# Altium schematic sheet Digital Circuitry.SchDoc
size A4; SheetNumber: 3; SheetTotal: 6
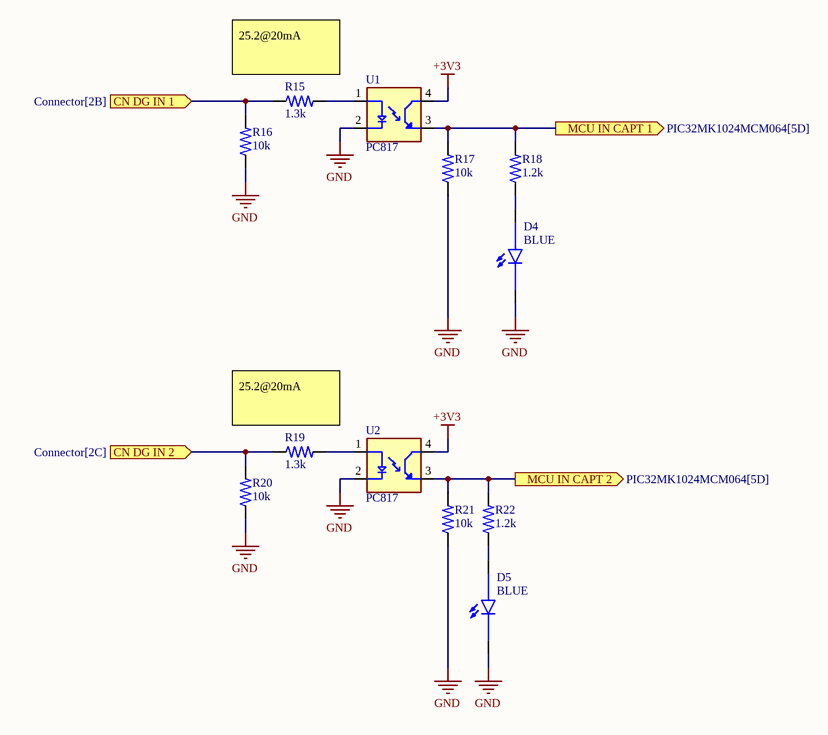
[diagram p0: Digital Circuitry.SchDoc]

## Parts
D4  BLUE  [LED 0805]
D5  BLUE  [LED 0805]
R15  1.3k  [0805]
R16  10k  [0805]
R17  10k  [0805]
R18  1.2k  [0805]
R19  1.3k  [0805]
R20  10k  [0805]
R21  10k  [0805]
R22  1.2k  [0805]
U1  PC817  [PC817]
U2  PC817  [PC817]

## Ports
CN DG IN 1 (in, see Connector[2B]), CN DG IN 2 (in, see Connector[2C]), MCU IN CAPT 1 (out, see PIC32MK1024MCM064[5D]), MCU IN CAPT 2 (out, see PIC32MK1024MCM064[5D])

## Nets
+3V3: U1.4(CT) U2.4(CT)
GND: D4.C D5.C R16.1 R17.1 R20.1 R21.1 U1.2(C) U2.2(C)
CN DG IN 1: R15.1 R16.2 ; port CN DG IN 1
CN DG IN 2: R19.1 R20.2 ; port CN DG IN 2
MCU IN CAPT 1: R17.2 R18.2 U1.3(ET) ; port MCU IN CAPT 1
MCU IN CAPT 2: R21.2 R22.2 U2.3(ET) ; port MCU IN CAPT 2
NetD4_A: D4.A R18.1
NetD5_A: D5.A R22.1
NetR15_2: R15.2 U1.1(A)
NetR19_2: R19.2 U2.1(A)

## Notes on the sheet
- 25.2@20mA

## Library data of the parts
D4 D5 = LED 0805: LED Uni-Color Green 4-Pin Chip 0805 T/R; MP: 597-3305-607F; Availability: Unavailable; Value: *; Price: None; Package: None
R15-R22 = 0805_Resistor: Power_Rating: .25 W; MP: 2-2176053-0; Tolerance: 1%; Resistance: .33; MF: TE Connectivity; Price: None; Availability: In Stock; EU_RoHS_Compliance: Compliant with Exemptions; Package: 0805; Value: *; SnapEDA_Link: https://www.snapeda.com/parts/2-2176053-0/TE+Connectivity/view-part/?ref=snap; Check_prices: https://www.snapeda.com/parts/2-2176053-0/TE+Connectivity/view-part/?ref=eda
U1 U2 = PC817: Optoisolator Transistor Output 5000Vrms 1 Channel 4-SMD; MP: PC817XI; MF: Sharp Microelectronics; Price: None; Availability: In Stock; Package: SMD-4 Sharp Microelectronics; Value: *; SnapEDA_Link: https://www.snapeda.com/parts/PC817XI/Sharp+Microelectronics/view-part/?ref=snap; Purchase-URL: https://pricing.snapeda.com/search/part/PC817XI/?ref=eda; Check_prices: https://www.snapeda.com/parts/PC817XI/Sharp+Microelectronics/view-part/?ref=eda